# EAGLE design panelBoard (EAGLE 6.5.0)
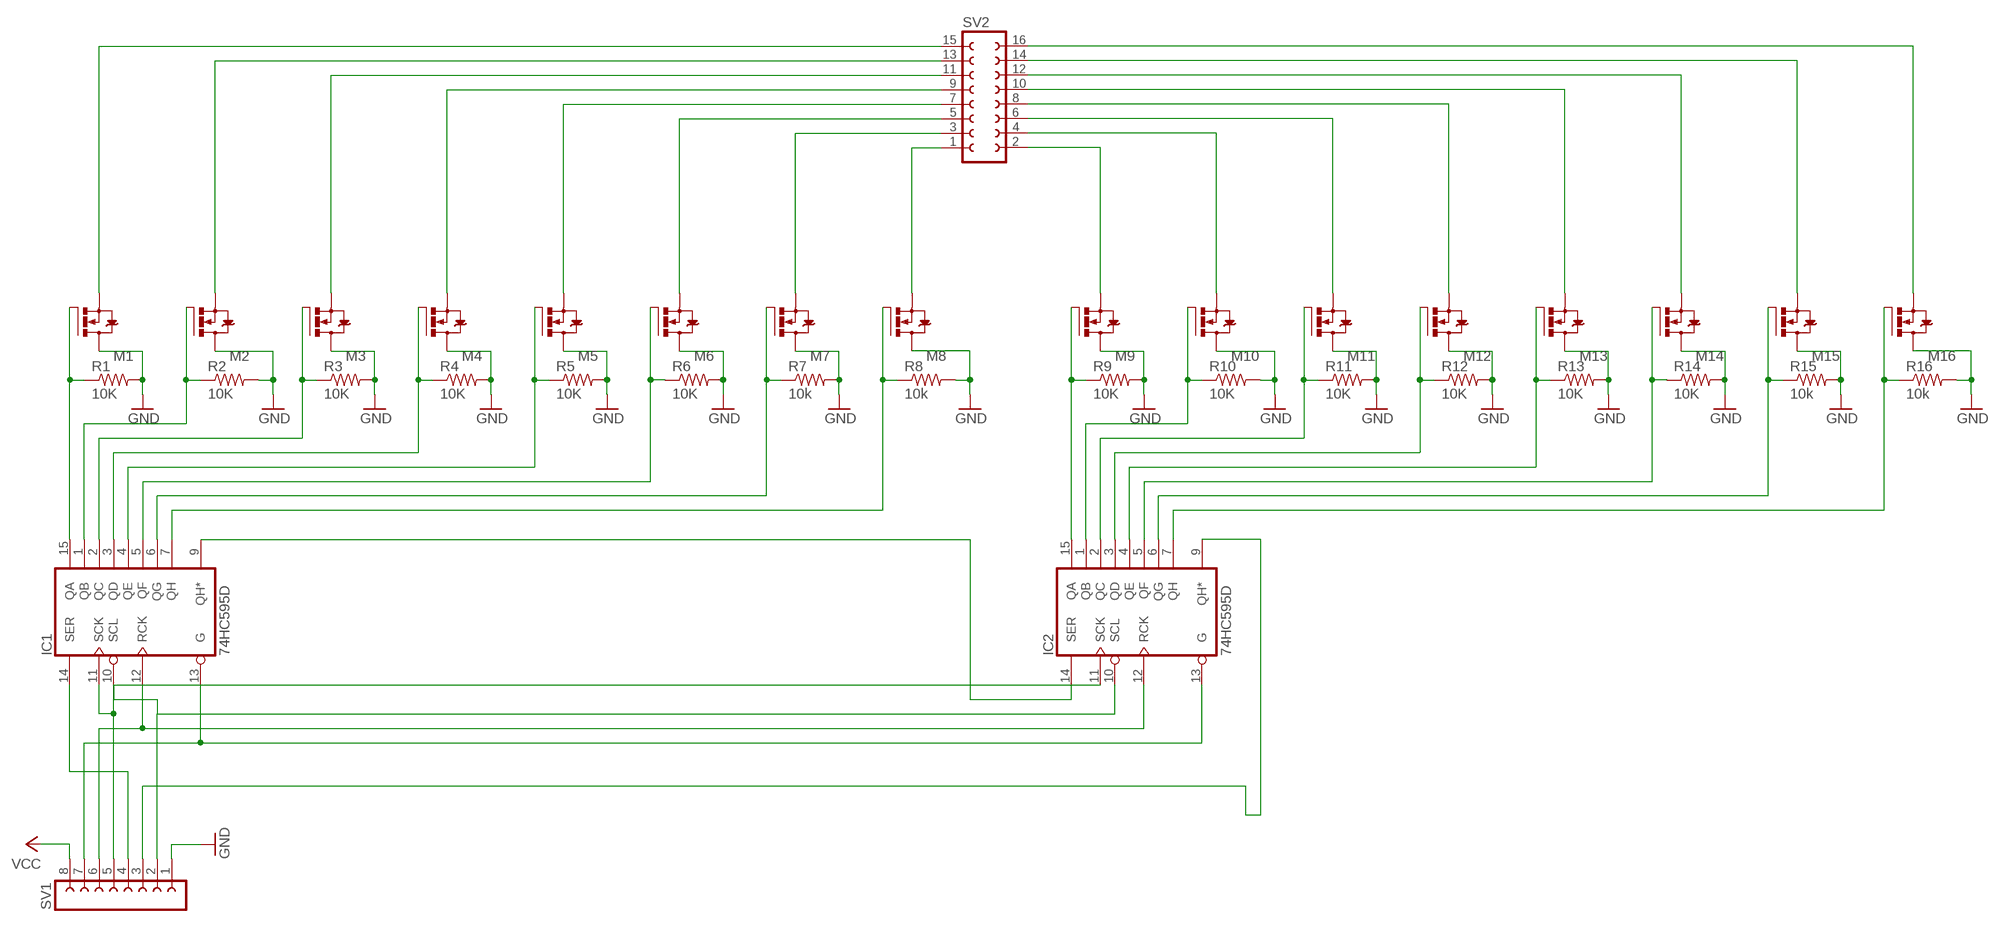
[diagram p0: schematic, sheet 1]

## Parts
IC1  74HC595D  [SO16]
IC2  74HC595D  [SO16]
M1  2N7000  [TO92D-]
M2  2N7000  [TO92D-]
M3  2N7000  [TO92D-]
M4  2N7000  [TO92D-]
M5  2N7000  [TO92D-]
M6  2N7000  [TO92D-]
M7  2N7000  [TO92D-]
M8  2N7000  [TO92D-]
M9  2N7000  [TO92D-]
M10  2N7000  [TO92D-]
M11  2N7000  [TO92D-]
M12  2N7000  [TO92D-]
M13  2N7000  [TO92D-]
M14  2N7000  [TO92D-]
M15  2N7000  [TO92D-]
M16  2N7000  [TO92D-]
R1  10K  R-US_R0603  [R0603]
R2  10K  R-US_R0603  [R0603]
R3  10K  R-US_R0603  [R0603]
R4  10K  R-US_R0603  [R0603]
R5  10K  R-US_R0603  [R0603]
R6  10K  R-US_R0603  [R0603]
R7  10k  R-US_R0603  [R0603]
R8  10k  R-US_R0603  [R0603]
R9  10K  R-US_R0603  [R0603]
R10  10K  R-US_R0603  [R0603]
R11  10K  R-US_R0603  [R0603]
R12  10K  R-US_R0603  [R0603]
R13  10K  R-US_R0603  [R0603]
R14  10K  R-US_R0603  [R0603]
R15  10k  R-US_R0603  [R0603]
R16  10k  R-US_R0603  [R0603]
SV1  FE08-1  [FE08]
SV2  FE08-2  [FE08-2]

## Nets
GND: M1.3(D) M2.3(D) M3.3(D) M4.3(D) M5.3(D) M6.3(D) M7.3(D) M8.3(D) M9.3(D) M10.3(D) M11.3(D) M12.3(D) M13.3(D) M14.3(D) M15.3(D) M16.3(D) R1.2 R2.2 R3.2 R4.2 R5.2 R6.2 R7.2 R8.2 R9.2 R10.2 R11.2 R12.2 R13.2 R14.2 R15.2 R16.2 SV1.1
N$1: M1.1(S) SV2.15
N$2: M2.1(S) SV2.13
N$3: M3.1(S) SV2.11
N$4: M4.1(S) SV2.9
N$5: M5.1(S) SV2.7
N$6: M6.1(S) SV2.5
N$7: M7.1(S) SV2.3
N$8: M8.1(S) SV2.1
N$10: IC1.7(QH) M8.2(G) R8.1
N$11: IC1.15(QA) M1.2(G) R1.1
N$12: IC1.1(QB) M2.2(G) R2.1
N$13: IC1.2(QC) M3.2(G) R3.1
N$14: IC1.3(QD) M4.2(G) R4.1
N$15: IC1.4(QE) M5.2(G) R5.1
N$16: IC1.5(QF) M6.2(G) R6.1
N$17: IC1.13(G) IC2.13(G) SV1.7
N$18: IC1.6(QG) M7.2(G) R7.1
N$19: IC1.12(RCK) IC2.12(RCK) SV1.6
N$20: IC1.11(SCK) IC2.11(SCK) SV1.5
N$21: IC1.14(SER) SV1.4
N$22: IC1.9(QH*) IC2.14(SER)
N$23: IC1.10(SCL) IC2.10(SCL) SV1.2
N$25: M9.1(S) SV2.2
N$26: M10.1(S) SV2.4
N$27: M11.1(S) SV2.6
N$28: M12.1(S) SV2.8
N$29: M13.1(S) SV2.10
N$30: M14.1(S) SV2.12
N$31: M15.1(S) SV2.14
N$32: M16.1(S) SV2.16
N$33: IC2.15(QA) M9.2(G) R9.1
N$34: IC2.1(QB) M10.2(G) R10.1
N$35: IC2.2(QC) M11.2(G) R11.1
N$36: IC2.3(QD) M12.2(G) R12.1
N$37: IC2.4(QE) M13.2(G) R13.1
N$38: IC2.5(QF) M14.2(G) R14.1
N$39: IC2.7(QH) M16.2(G) R16.1
N$40: IC2.6(QG) M15.2(G) R15.1
N$45: IC2.9(QH*) SV1.3
VCC: SV1.8

## Power pins joined to a net without a drawn wire
GND: IC1.8(GND) IC2.8(GND)
VCC: IC1.16(VCC) IC2.16(VCC)

## Library data of the parts
IC1 IC2 = 74xx-eu:74*595: 8-bit SHIFT REGISTER, output latch; OC_NEWARK: unknown
M1-M16 = ads4:2N7000: 2N7000 N-Channel Logic-Level MOSFET; OC_NEWARK: unknown
R1-R16 = resistor:R-US_: RESISTOR, American symbol; OC_NEWARK: unknown
SV1 = con-lsta:FE08-1: FEMALE HEADER; OC_FARNELL: unknown; OC_NEWARK: unknown
SV2 = con-lsta:FE08-2: FEMALE HEADER; OC_FARNELL: unknown; OC_NEWARK: unknown

## Net classes
0 default: width 0.381 mm, drill 0.508 mm, clearance 0.254 mm

## Board
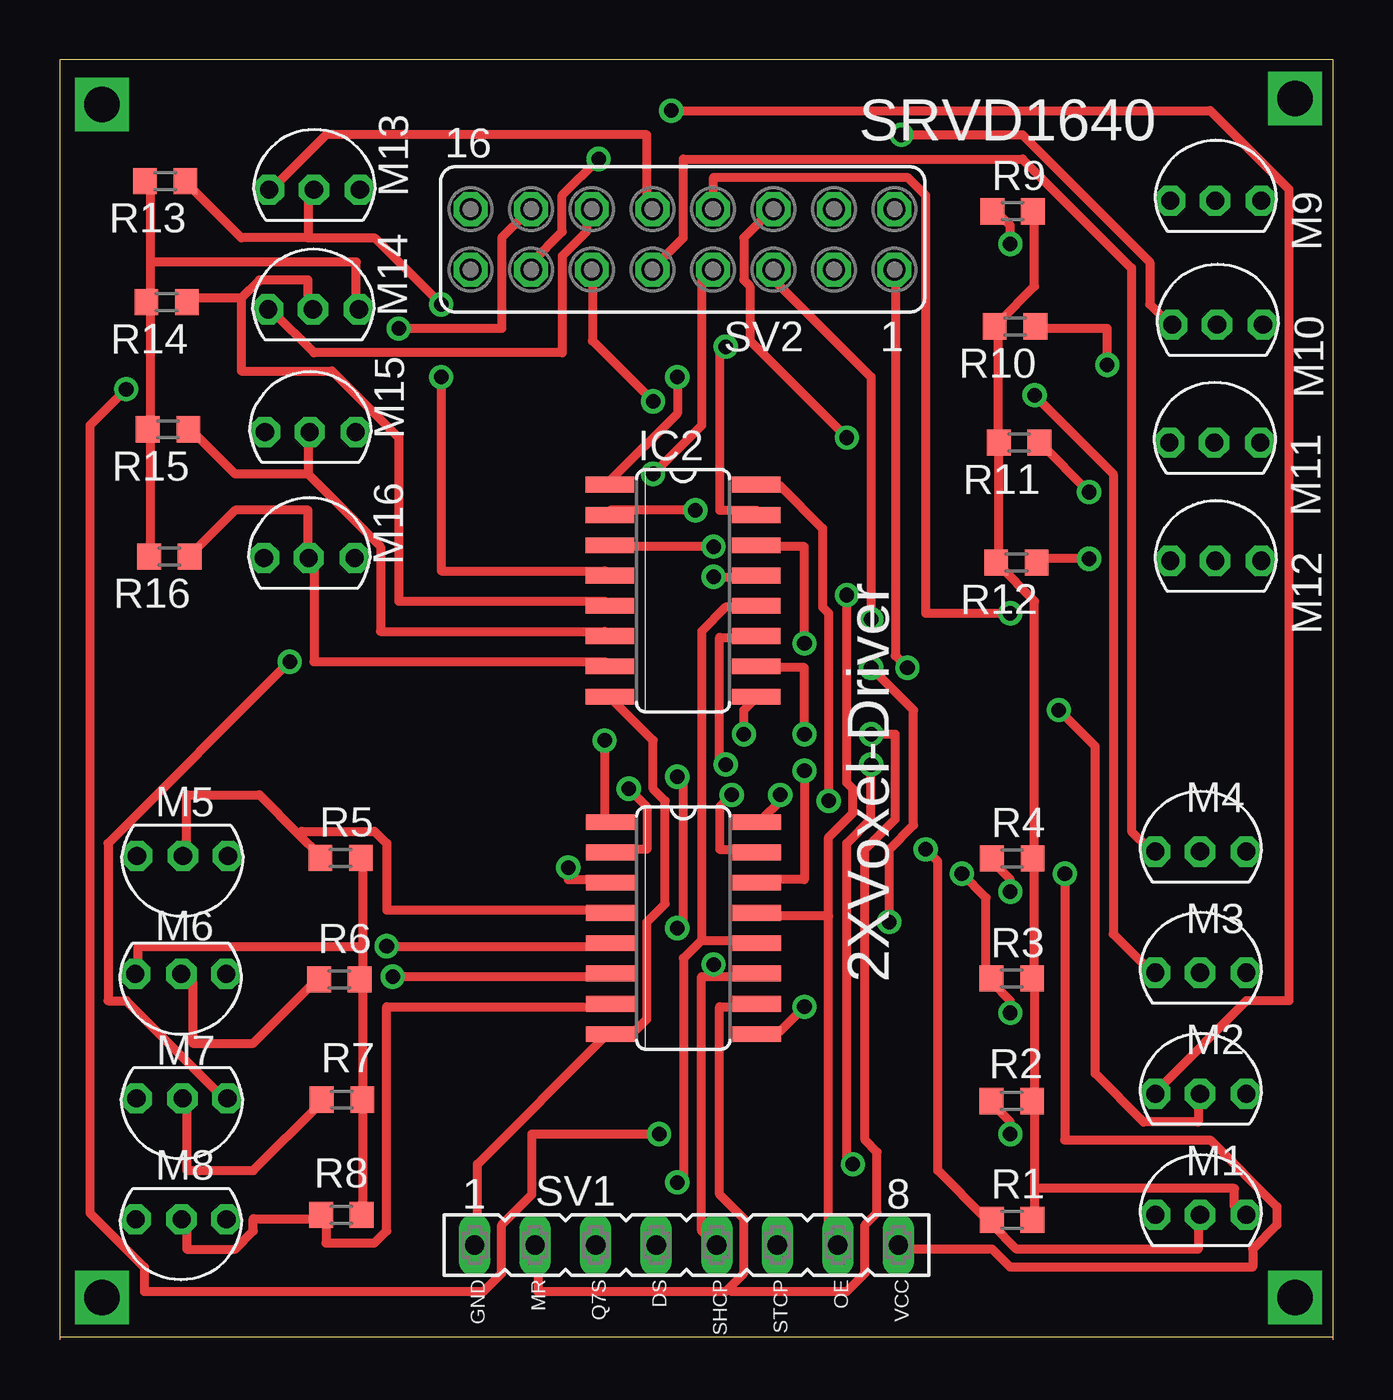
[diagram p1: board, top side]
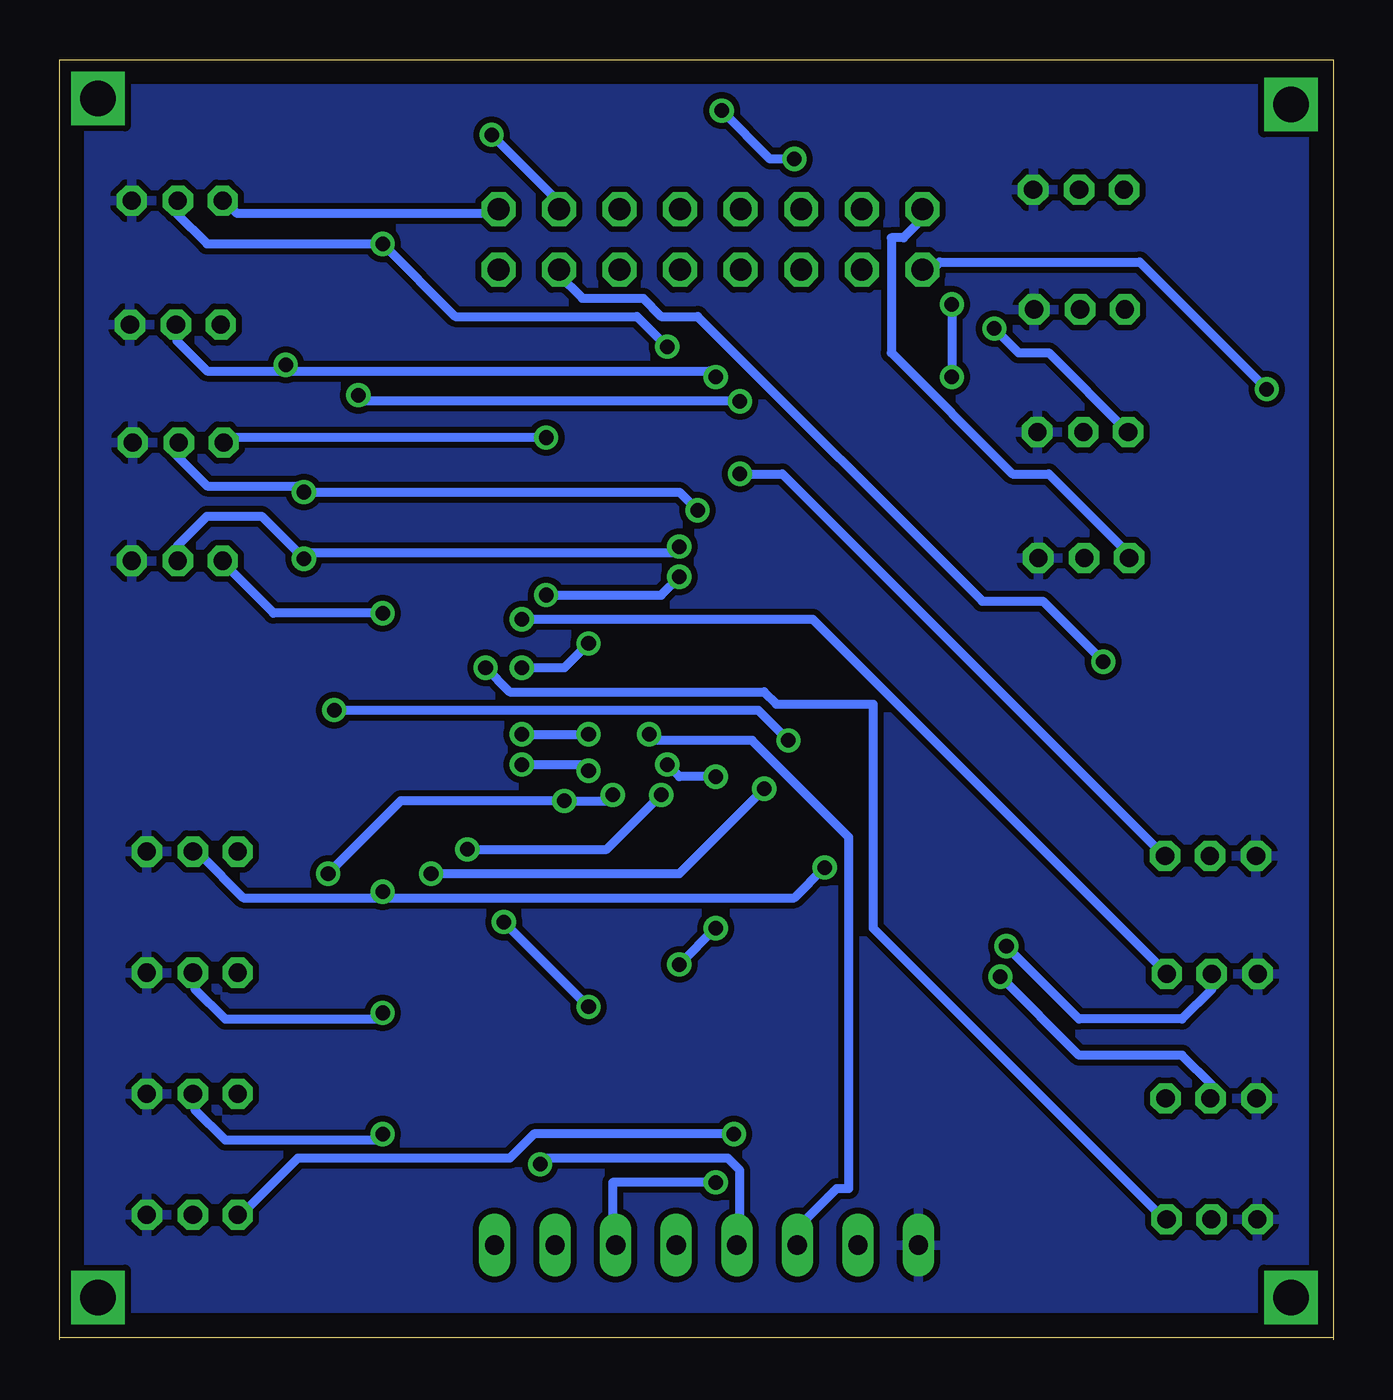
[diagram p2: board, bottom side, seen from below]

Size 53.43 x 53.7 mm. Coordinates in mm from the lower left corner, seen from the top.
Outline: 53.43,0 53.43,0.11
Outline: 53.43,0.11 53.43,53.7 0,53.7 0,0.11
Outline: 0,0.11 0,0
Outline: 53.43,0.11 0,0.11
Copper layers (1*16): Top 0.035mm / dielectric 1.5mm / Bottom 0.035mm
Design rules "default": minimum track width 10mil, minimum drill 24mil, track to track 8mil, track to pad 8mil, pad to pad 8mil, via to via 8mil, smd to smd 8mil, copper to edge 40mil, drill to drill 8mil, minimum pad ring 10mil, minimum via ring 8mil, stop-mask expansion 4mil, vias tented up to drill 0mil, thermal gap 10mil

### Footprints (pad centres in the part's own frame; a part is rotated, then mirrored left to right if it is on the bottom)
SO16 = smd 0.66 x 2.032: 1 -4.445,-3.073; 2 -3.175,-3.073; 3 -1.905,-3.073; 4 -0.635,-3.073; 5 0.635,-3.073; 6 1.905,-3.073; 7 3.175,-3.073; 8 4.445,-3.073; 9 4.445,3.073; 10 3.175,3.073; 11 1.905,3.073; 12 0.635,3.073; 13 -0.635,3.073; 14 -1.905,3.073; 15 -3.175,3.073; 16 -4.445,3.073
TO92D- = drill 0.762 octagon: 1 -1.905,0; 2 -0.025,0; 3 1.905,0
R0603 = smd 1 x 1.1: 1 -0.85,0; 2 0.85,0
FE08 = drill 0.813 long: 1 -8.89,0; 2 -6.35,0; 3 -3.81,0; 4 -1.27,0; 5 1.27,0; 6 3.81,0; 7 6.35,0; 8 8.89,0
FE08-2 = drill 0.914 octagon: 1 -8.89,1.27; 2 -8.89,-1.27; 3 -6.35,1.27; 4 -6.35,-1.27; 5 -3.81,1.27; 6 -3.81,-1.27; 7 -1.27,1.27; 8 -1.27,-1.27; 9 1.27,1.27; 10 1.27,-1.27; 11 3.81,1.27; 12 3.81,-1.27; 13 6.35,1.27; 14 6.35,-1.27; 15 8.89,1.27; 16 8.89,-1.27

### Placement (x,y rotation side)
IC1  26.16,17.27 270 top
IC2  26.15,31.42 270 top
M1  47.86,5.24 0 top
M2  47.86,10.32 0 top
M3  47.86,15.4 0 top
M4  47.86,20.48 0 top
M5  5.15,20.3 180 top
M6  5.08,15.35 180 top
M7  5.13,10.13 180 top
M8  5.09,5.06 180 top
M9  48.49,47.78 0 top
M10  48.57,42.58 0 top
M11  48.45,37.63 0 top
M12  48.49,32.67 0 top
M13  10.69,48.24 0 top
M14  10.65,43.22 0 top
M15  10.52,38.08 0 top
M16  10.47,32.8 0 top
R1  39.95,5.04 0 top
R2  39.94,10.02 0 top
R3  39.94,15.16 0 top
R4  39.96,20.2 0 top
R5  11.79,20.22 0 top
R6  11.73,15.12 0 top
R7  11.85,10.08 0 top
R8  11.82,5.24 0 top
R9  39.98,47.34 0 top
R10  40.07,42.51 180 top
R11  40.24,37.63 180 top
R12  40.13,32.6 180 top
R13  4.43,48.61 180 top
R14  4.49,43.53 180 top
R15  4.55,38.19 180 top
R16  4.61,32.86 180 top
SV1  26.29,3.97 0 top
SV2  26.13,46.16 180 top

### Tracks (layer width: path | path; a pad name or v marks a point on that pad's centre or on a via)
GND
  Top 0.381: IC2.8 23.11,26.92 24.89,25.15 24.89,23.11 25.4,22.61 25.4,18.29 24.64,17.53 24.64,13.46 24.13,12.95 23.11,12.95 IC1.8 22.86,12.7 17.53,7.37 17.53,4.06 SV1.1 | R9.2 40.89,47.24 40.89,44.2 39.37,42.67 R10.2 39.37,42.42 39.37,37.85 R11.2 39.37,37.59 39.37,32.77 R12.2 39.37,32.51 40.89,30.99 40.89,20.32 R4.2 40.89,20.07 40.89,15.24 R3.2 40.89,14.99 40.89,10.16 R2.2 40.89,9.91 40.89,6.35 | 3.81,45.21 3.81,48.51 R13.2 | 3.81,45.21 3.81,43.69 R14.2 3.81,43.43 3.81,38.35 R15.2 3.81,38.1 3.81,33.02 R16.2 | 40.89,6.35 40.89,5.08 R1.2 | R8.2 12.7,5.33 12.7,9.91 R7.2 12.7,10.16 12.7,14.99 R6.2 12.7,15.24 12.7,16.51 | 12.7,16.51 12.7,20.07 R5.2 | 12.7,16.51 3.3,16.51 3.3,15.49 M6.3 | 40.89,6.35 49.28,6.35 49.28,5.59 49.53,5.33 M1.3 | 3.81,45.21 12.45,45.21 12.45,43.43 M14.3
  pour Bottom: 0,77.47 89.68,77.73 89.26,-0.34 -0.43,-0.6
N$1  (via drill 0.61)
  Top 0.381: v25.15,8.64 19.81,8.64 19.81,6.1 18.54,4.83 18.54,2.79 17.78,2.03 3.56,2.03 3.56,3.05 1.27,5.33 1.27,38.35 v2.79,39.88
  Bottom 0.381: v25.15,8.64 33.53,8.64 34.54,7.62 43.43,7.62 45.72,5.33 M1.1 | v2.79,39.88 8.13,45.21 16.51,45.21 16.76,44.96 17.02,44.96 SV2.15
N$2  (via drill 0.61)
  Top 0.381: v25.65,51.56 48.26,51.56 51.56,48.26 51.56,14.22 49.78,14.22 45.97,10.41 M2.1 | v22.61,49.53 21.08,48.01 21.08,46.48 19.81,45.21 19.81,44.96 SV2.13
  Bottom 0.381: v25.65,51.56 23.62,49.53 v22.61,49.53
N$3  (via drill 0.61)
  Top 0.381: v40.89,39.62 44.2,36.32 44.2,17.02 45.72,15.49 M3.1 | v24.89,39.37 22.35,41.91 22.35,44.7 SV2.11
  Bottom 0.381: v40.89,39.62 40.64,39.37 v24.89,39.37
N$4
  Top 0.381: M4.1 45.72,20.57 44.96,21.34 44.96,44.96 40.39,49.53 26.16,49.53 26.16,46.23 24.89,44.96 SV2.9
N$5  (via drill 0.61)
  Top 0.381: v24.89,36.32 26.92,38.35 26.92,44.45 27.18,44.7 SV2.7
  Bottom 0.381: v24.89,36.32 23.11,36.32 7.11,20.32 M5.1
N$6  (via drill 0.61)
  Top 0.381: v34.04,30.23 34.04,40.39 29.97,44.45 29.97,44.7 SV2.5
  Bottom 0.381: v34.04,30.23 21.84,30.23 7.11,15.49 M6.1
N$7  (via drill 0.61)
  Top 0.381: v9.65,28.45 2.03,20.83 2.03,14.22 2.79,14.22 6.86,10.16 M7.1
  Bottom 0.381: v9.65,28.45 12.19,30.99 14.73,30.99 26.67,42.93 28.19,42.93 28.96,43.69 31.5,43.69 32.51,44.7 SV2.3
N$8  (via drill 0.61)
  Top 0.381: v35.56,28.19 35.05,28.7 35.05,44.7 SV2.1
  Bottom 0.381: v35.56,28.19 34.54,27.18 23.88,27.18 23.37,26.67 19.3,26.67 19.3,17.27 7.11,5.08 M8.1
N$9  (via drill 1.5)
  other vias: 51.82,52.07
N$10
  Top 0.381: M8.2 5.33,4.83 5.33,3.81 7.37,3.81 8.13,4.57 8.13,5.08 10.92,5.08 R8.1 11.18,5.08 11.18,4.06 13.21,4.06 13.72,4.57 13.72,13.97 22.86,13.97 IC1.7
N$11  (via drill 0.61)
  Top 0.381: M1.2 47.75,5.08 47.75,3.81 40.13,3.81 39.12,4.83 R1.1 38.86,5.08 36.83,7.11 36.83,20.07 v36.32,20.57 | v28.19,22.86 27.69,22.35 27.69,20.57 29.21,20.57 IC1.15
  Bottom 0.381: v28.19,22.86 30.48,20.57 v36.32,20.57
N$12  (via drill 0.61)
  Top 0.381: v39.88,8.64 39.88,9.14 39.12,9.91 R2.1 | v22.86,25.15 22.86,21.84 IC1.1 | v41.91,26.42 43.43,24.89 43.43,11.18 45.47,9.14 47.75,9.14 47.75,10.16 M2.2
  Bottom 0.381: v39.88,8.64 40.13,8.38 46.48,8.38 47.75,9.65 47.75,10.16 M2.2 | v22.86,25.15 24.13,26.42 v41.91,26.42
N$13  (via drill 0.61)
  Top 0.381: v39.88,13.72 39.88,14.22 39.12,14.99 R3.1 38.86,15.24 38.86,18.54 v37.85,19.56 | v23.88,23.11 24.64,22.35 24.64,20.57 23.11,20.57 IC1.2
  Bottom 0.381: v39.88,13.72 40.13,13.46 46.48,13.46 47.75,14.73 47.75,15.24 M3.2 | v23.88,23.11 27.43,19.56 v37.85,19.56
N$14  (via drill 0.61)
  Top 0.381: v39.88,18.8 39.88,19.3 39.12,20.07 R4.1 | v21.34,19.81 21.34,19.3 22.86,19.3 IC1.3
  Bottom 0.381: M4.2 47.75,20.32 47.5,20.32 45.72,18.54 40.13,18.54 v39.88,18.8 39.88,18.54 22.61,18.54 v21.34,19.81
N$15
  Top 0.381: 10.03,21.21 8.38,22.86 5.33,22.86 5.33,20.32 M5.2 | 10.03,21.21 10.92,20.32 R5.1 | IC1.4 22.86,18.03 13.72,18.03 13.72,20.83 13.21,21.34 10.16,21.34 10.03,21.21
N$16  (via drill 0.61)
  Top 0.381: R6.1 10.67,14.99 8.13,12.45 5.59,12.45 5.59,14.99 5.33,15.24 M6.2 | v13.72,16.51 22.86,16.51 IC1.5
  Bottom 0.381: v13.72,16.51 10.67,13.46 6.35,13.46 5.08,14.73 5.08,15.24 M6.2
N$17  (via drill 0.61)
  Top 0.381: 32.26,17.78 29.46,17.78 IC1.13 | 32.26,17.78 32.26,4.32 32.51,4.06 SV1.7 | v27.43,32 29.21,32 IC2.13 | v33.02,31.24 33.02,23.37 33.27,23.11 33.27,22.1 32.26,21.08 32.26,17.78
  Bottom 0.381: v27.43,32 28.19,31.24 v33.02,31.24
N$18  (via drill 0.61)
  Top 0.381: R7.1 10.92,9.91 8.13,7.11 5.33,7.11 5.33,9.91 M7.2 | v13.97,15.24 22.86,15.24 IC1.6
  Bottom 0.381: v13.97,15.24 10.67,11.94 6.35,11.94 5.08,10.67 5.08,10.16 M7.2
N$19  (via drill 0.61)
  Top 0.381: 26.92,16.76 29.21,16.76 IC1.12 | 26.92,16.76 26.92,29.72 27.94,30.73 29.21,30.73 IC2.12 | v25.91,6.6 26.16,6.86 26.16,16 26.92,16.76
  Bottom 0.381: v25.91,6.6 30.23,6.6 30.23,4.06 SV1.6
N$20  (via drill 0.61)
  Top 0.381: 27.43,15.24 26.92,15.24 26.92,4.57 27.43,4.06 SV1.5 | 27.43,15.24 29.21,15.24 IC1.11 | v27.94,24.13 27.69,24.38 27.69,29.46 29.21,29.46 IC2.11 | v25.91,23.62 26.16,23.37 26.16,17.53 v25.91,17.27 | 27.43,15.24 v27.43,15.75
  Bottom 0.381: v27.94,24.13 27.43,23.62 v25.91,23.62 | v27.43,15.75 v25.91,17.27
N$21  (via drill 0.61)
  Top 0.381: v31.24,23.88 31.24,19.3 29.46,19.3 IC1.14 | v34.04,24.13 34.04,21.84 33.02,20.83 33.02,7.62 v33.27,7.37
  Bottom 0.381: v31.24,23.88 31.5,24.13 v34.04,24.13 | v33.27,7.37 33.02,7.62 25.4,7.62 24.89,7.11 24.89,4.06 SV1.4
N$22  (via drill 0.61)
  Top 0.381: v31.24,29.21 31.24,33.27 29.46,33.27 IC2.14 | v34.04,28.19 35.81,26.42 35.81,21.59 34.8,20.57 v34.8,17.53 | v31.24,13.97 30.23,12.95 29.46,12.95 IC1.9
  Bottom 0.381: v31.24,29.21 32.26,28.19 v34.04,28.19 | v31.24,13.97 v34.8,17.53
N$23  (via drill 0.61)
  Top 0.381: 28.07,2.16 27.94,2.03 20.07,2.03 20.07,3.81 SV1.2 | 28.07,2.16 28.7,2.79 28.7,5.08 27.69,6.1 27.69,13.97 29.21,13.97 IC1.10 | v31.24,25.4 31.24,28.19 29.46,28.19 IC2.10 | v34.04,25.4 35.05,25.4 35.05,21.84 33.78,20.57 33.78,8.38 34.29,7.87 34.29,5.33 33.78,4.83 33.78,2.79 33.02,2.03 28.19,2.03 28.07,2.16
  Bottom 0.381: v34.04,25.4 v31.24,25.4
N$24  (via drill 1.5)
  other vias: 1.78,51.82
N$25
  Bottom 0.381: M9.1 46.48,47.75 45.97,47.24 35.05,47.24 SV2.2
N$26  (via drill 0.61)
  Top 0.381: v35.31,50.55 40.39,50.55 45.72,45.21 45.72,43.43 46.48,42.67 M10.1
  Bottom 0.381: v35.31,50.55 32.26,47.5 SV2.4
N$27  (via drill 0.61)
  Top 0.381: v33.02,37.85 28.96,41.91 28.96,44.2 28.7,44.45 28.7,46.23 29.72,47.24 SV2.6
  Bottom 0.381: v33.02,37.85 46.48,37.85 M11.1
N$28  (via drill 0.61)
  Top 0.381: v39.88,30.48 36.32,30.48 36.32,48.01 35.56,48.77 27.43,48.77 27.43,47.5 SV2.8
  Bottom 0.381: v39.88,30.48 44.45,30.48 46.48,32.51 M12.1
N$29
  Top 0.381: M13.1 8.89,48.26 11.18,50.55 24.64,50.55 24.64,47.5 SV2.10
N$30
  Top 0.381: M14.1 8.89,43.18 10.67,41.4 21.08,41.4 21.08,45.47 22.1,46.48 22.1,47.24 SV2.12
N$31  (via drill 0.61)
  Top 0.381: v14.22,42.42 18.54,42.42 18.54,46.23 19.56,47.24 SV2.14
  Bottom 0.381: v14.22,42.42 13.21,41.4 11.94,41.4 8.64,38.1 M15.1
N$32
  Bottom 0.381: M16.1 8.64,33.02 11.94,36.32 13.46,36.32 18.54,41.4 18.54,46.23 18.03,46.23 17.02,47.24 SV2.16
N$33  (via drill 0.61)
  Top 0.381: v39.88,45.97 39.88,46.74 39.37,47.24 R9.1 | v27.94,41.66 27.69,41.4 27.69,34.8 29.21,34.8 IC2.15
  Bottom 0.381: M9.2 48.51,47.75 48.51,47.24 47.24,45.97 v39.88,45.97 36.83,42.93 29.21,42.93 v27.94,41.66
N$34  (via drill 0.61)
  Top 0.381: v43.94,40.89 43.94,42.42 41.15,42.42 R10.1 | v25.91,40.39 25.91,38.86 23.11,36.07 IC2.1
  Bottom 0.381: M10.2 48.51,42.42 48.51,41.91 47.24,40.64 44.2,40.64 v43.94,40.89 43.94,40.64 26.16,40.64 v25.91,40.39
N$35  (via drill 0.61)
  Top 0.381: v43.18,35.56 41.15,37.59 R11.1 | v26.67,34.8 23.11,34.8 IC2.2
  Bottom 0.381: M11.2 48.51,37.59 48.51,37.08 47.24,35.81 43.43,35.81 v43.18,35.56 27.43,35.56 v26.67,34.8
N$36  (via drill 0.61)
  Top 0.381: v43.18,32.77 41.15,32.77 R12.1 | v27.43,33.27 23.11,33.27 IC2.3
  Bottom 0.381: M12.2 48.51,32.77 48.51,33.27 47.24,34.54 44.96,34.54 v43.18,32.77 43.18,33.02 27.69,33.02 v27.43,33.27
N$37  (via drill 0.61)
  Top 0.381: 10.41,46.23 7.62,46.23 5.33,48.51 R13.1 | 10.41,46.23 10.41,48.01 M13.2 | v16,40.39 16,32.26 22.86,32.26 IC2.4 | v16,43.43 13.21,46.23 10.41,46.23
  Bottom 0.381: v16,43.43 v16,40.39
N$38
  Top 0.381: 7.62,43.69 5.59,43.69 R14.1 | 7.62,43.69 8.38,44.45 10.41,44.45 10.41,43.43 M14.2 | 7.62,43.69 7.62,40.64 11.43,40.64 14.22,37.85 14.22,30.99 22.86,30.99 IC2.5
N$39
  Top 0.381: R16.1 5.59,33.02 7.37,34.8 10.41,34.8 10.41,33.02 M16.2 10.67,32.77 10.67,28.45 22.86,28.45 IC2.7
N$40
  Top 0.381: 10.41,36.32 7.37,36.32 5.59,38.1 R15.1 | 10.41,36.32 10.41,37.85 M15.2 | 10.41,36.32 13.46,33.27 13.46,29.72 22.86,29.72 IC2.6
N$41  (via drill 1.5)
  other vias: 1.78,1.78
N$42  (via drill 1.5)
  other vias: 51.82,1.78
N$45  (via drill 0.61)
  Top 0.381: v28.7,25.4 28.7,26.42 29.21,26.92 IC2.9
  Bottom 0.381: v28.7,25.4 28.45,25.15 24.38,25.15 20.32,21.08 20.32,6.35 20.83,6.35 22.35,4.83 22.35,4.06 SV1.3
VCC  (via drill 0.61)
  Top 0.381: v30.23,22.86 30.23,22.61 29.46,21.84 IC1.16 | v32.26,22.61 32.26,30.48 32,30.73 32,34.04 30.23,35.81 29.46,35.81 IC2.16 | v42.16,19.56 42.16,8.38 48.26,8.38 51.05,5.59 51.05,4.83 50.04,3.81 50.04,3.05 39.88,3.05 39.12,3.81 35.31,3.81 SV1.8
  Bottom 0.381: v30.23,22.86 30.48,22.61 v32.26,22.61 39.12,22.61 v42.16,19.56

### Text on the board
tNames: SRVD1640 | 2XVoxel-Driver | GND | MR | Q7S | DS | SHCP | STCP | OE | VCC
200bmp: Society of / Software Engineers
201bmp: Most Excellent!